# Altium schematic sheet SegmentDriver.SchDoc: LiveDesign Evaluation - Countdown
size A4; Organization: Altium Limited; Address1: L3, 12a Rodborough Rd; Address2: Frenchs Forest; Address3: NSW; Address4: Australia 2086; DocumentNumber: 4; SheetNumber: 4; SheetTotal: 11
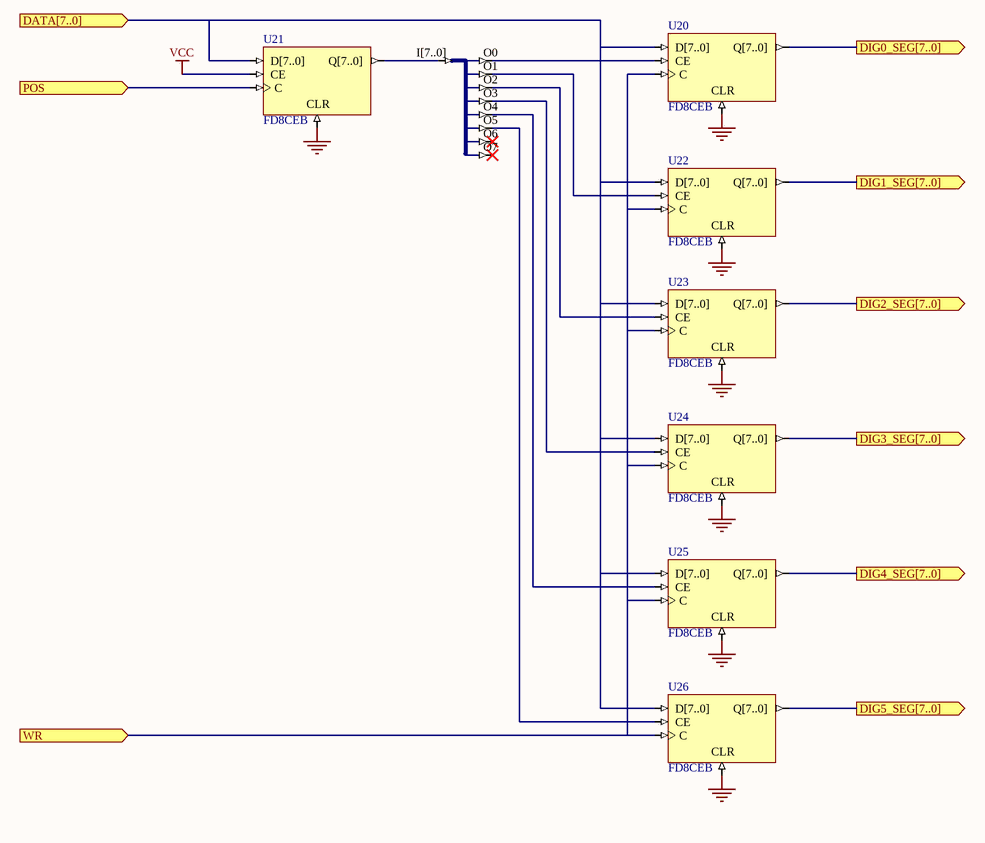
[diagram p0: SegmentDriver.SchDoc]

## Parts
U19  J8B_8S  (value not drawn)
U20  FD8CEB
U21  FD8CEB
U22  FD8CEB
U23  FD8CEB
U24  FD8CEB
U25  FD8CEB
U26  FD8CEB

## Ports
DATA[7..0] (in), DIG0_SEG[7..0] (out), DIG1_SEG[7..0] (out), DIG2_SEG[7..0] (out), DIG3_SEG[7..0] (out), DIG4_SEG[7..0] (out), DIG5_SEG[7..0] (out), POS (in), WR (in)

## Nets
GND: U20.CLR U21.CLR U22.CLR U23.CLR U24.CLR U25.CLR U26.CLR
VCC: U21.CE
DATA[7..0]: U20.D[7..0] U21.D[7..0] U22.D[7..0] U23.D[7..0] U24.D[7..0] U25.D[7..0] U26.D[7..0] ; port DATA[7..0]
DIG0_SEG[7..0]: U20.Q[7..0] ; port DIG0_SEG[7..0]
DIG1_SEG[7..0]: U22.Q[7..0] ; port DIG1_SEG[7..0]
DIG2_SEG[7..0]: U23.Q[7..0] ; port DIG2_SEG[7..0]
DIG3_SEG[7..0]: U24.Q[7..0] ; port DIG3_SEG[7..0]
DIG4_SEG[7..0]: U25.Q[7..0] ; port DIG4_SEG[7..0]
DIG5_SEG[7..0]: U26.Q[7..0] ; port DIG5_SEG[7..0]
POS: U21.C ; port POS
WR: U20.C U22.C U23.C U24.C U25.C U26.C ; port WR
NetU19_I[7..0]: U19.I[7..0] U21.Q[7..0]
NetU19_O0: U19.O0 U20.CE
NetU19_O1: U19.O1 U22.CE
NetU19_O2: U19.O2 U23.CE
NetU19_O3: U19.O3 U24.CE
NetU19_O4: U19.O4 U25.CE
NetU19_O5: U19.O5 U26.CE

Not connected (* = marked no-connect by the designer): U19 O6* O7*

## Notes on the sheet
- Title
- Size:
- Date:
- A4
- Number:
- Time:
- Revision:
- Sheet
- of
- File:

## Library data of the parts
U19 = J8B_8S: 8-Bit input bus to 8 single pin outputs; ArchiveName: GENERIC; VHDLIB_SIM: GENERIC_LIB; Published: 29-Jan-2004; Publisher: Altium Limited; Core Revision: 1.00.00
U20-U26 = FD8CEB: 8-Bit D-Type Flip-Flop with Clock Enable and Asynchronous Clear, Bus Version; ArchiveName: GENERIC; VHDLIB_SIM: GENERIC_LIB; Xilinx Equivalent: FD8CE; Published: 29-Jan-2004; Publisher: Altium Limited; Core Revision: 1.00.00